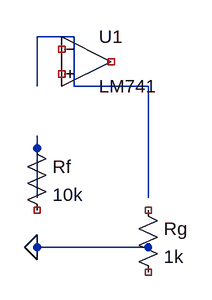
[diagram p0: schematic non_inverting_opamp.asc]
non_inverting_opamp.asc, the LTspice schematic file:
Version 4
SHEET 1 880 680
WIRE 240 96 192 96
WIRE 192 160 192 96
WIRE 240 160 240 96
WIRE 336 160 240 160
WIRE 192 240 192 224
WIRE 336 240 336 160
WIRE 192 304 192 240
WIRE 336 304 336 240
WIRE 192 368 192 368
WIRE 336 368 336 368
WIRE 336 368 192 368
FLAG 192 368 0
SYMBOL Opamps\opamp 256 64 R0
SYMATTR InstName U1
SYMATTR Value LM741
SYMBOL res 176 224 R0
SYMATTR InstName Rf
SYMATTR Value 10k
SYMBOL res 320 304 R0
SYMATTR InstName Rg
SYMATTR Value 1k

The netlist it stands for:
* non_inverting_opamp.asc
XU1 NC_01 NC_02 NC_03 LM741 Aol=100K GBW=10Meg  ; pins invin noninvin out
Rf N002 NC_04 10k
Rg NC_05 NC_06 1k
.backanno
.end